# EAGLE schematic Board (EAGLE 7.6.0)
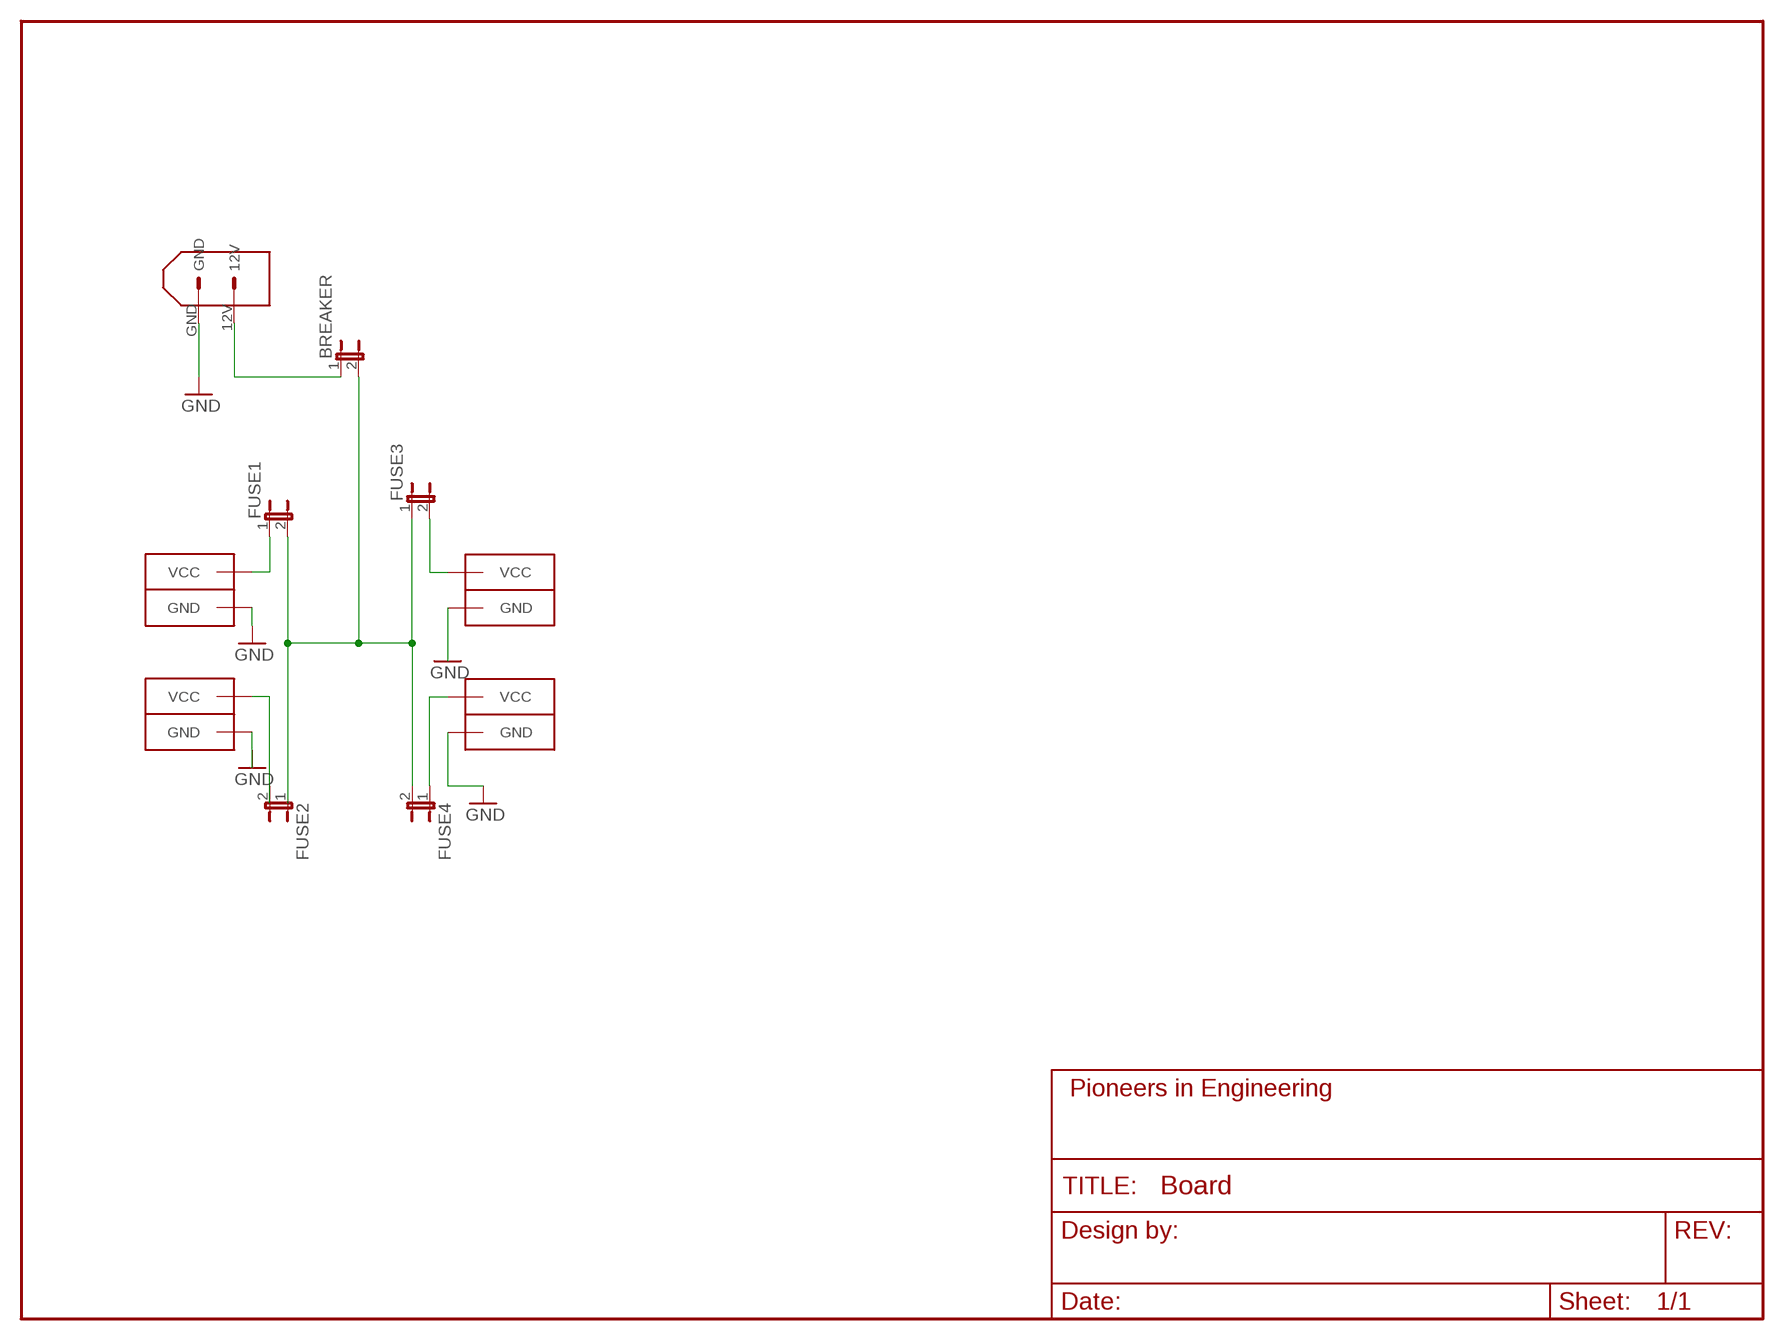
[diagram p0: schematic, sheet 1]

## Parts
BREAKER  JP1E  [JP1]
CONN1  ANDERSONHORIZONTAL  [ANDERSON_HORIZONTAL]
CONN2  ANDERSONHORIZONTAL  [ANDERSON_HORIZONTAL]
CONN4  ANDERSONHORIZONTAL  [ANDERSON_HORIZONTAL]
CONN5  ANDERSONHORIZONTAL  [ANDERSON_HORIZONTAL]
FUSE1  JP1E  [JP1]
FUSE2  JP1E  [JP1]
FUSE3  JP1E  [JP1]
FUSE4  JP1E  [JP1]
U$1  XT60CONNECTOR  [XT60CONNECTOR]

## Nets
12V: BREAKER.1 BREAKER.2 FUSE1.2 FUSE3.1 FUSE4.2 U$1.12V
GND: CONN2.PIN1(GND) CONN2.PIN1-LEAD(GND) CONN5.PIN1(GND) CONN5.PIN1-LEAD(GND) U$1.GND
N$1: CONN2.PIN2(VCC) CONN2.PIN2-LEAD(VCC) FUSE1.1
N$3: CONN1.PIN2(VCC) CONN1.PIN2-LEAD(VCC)
N$4: CONN5.PIN2(VCC) CONN5.PIN2-LEAD(VCC) FUSE4.1
N$5: CONN4.PIN2(VCC) CONN4.PIN2-LEAD(VCC) FUSE3.2
N$6: CONN4.PIN1(GND) CONN4.PIN1-LEAD(GND)
N$8: CONN1.PIN1(GND) CONN1.PIN1-LEAD(GND)
Unconnected: FUSE2.1 FUSE2.2

## Library data of the parts
BREAKER FUSE1-FUSE4 = jumper:JP1E: JUMPER
CONN1 CONN2 CONN4 CONN5 = pie:ANDERSON: 2-pin 25A Anderson Connector http://www.alliedelec.com/images/products/datasheets/bm/ANDERSON_POWER_PRODUCTS/70162018.pdf; PIE-INT-REF-NUM: Anderson
U$1 = pie:XT60CONNECTOR: 12V XT60 power connector; PARTNUMBER: PRT-10474